# Altium schematic sheet Display LED 7s x6 + 8x8 x4.SchDoc
size 209 x 297 mm; Author: Мурашкин Д.В.; Address1: Address1; Address2: Address2; Address3: Address3; Address4: Address4; DocumentNumber: АБВГ.123456.001 Э3; Scale: 1:1; Letter1Column: Э; PartName: Деталь
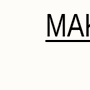
[diagram p0: Display LED 7s x6 + 8x8 x4.SchDoc]

## Notes on the sheet
- MAKING A 8×40 LED MATRIX <http://embedded-lab.com/blog/making-a-8x40-led-matrix-marquee-using-shift-registers/>
- Перв. примен.
- Справ. №
- Подп. и дата
- Инв. № дубл.
- Взам. инв. №
- Разраб.
- Изм.
- Лист
- № докум.
- Подп.
- Дата
- Лит.
- Масса
- Масштаб
- Пров.
- Т.контр.
- Листов
- Инв. № подл.
- Утв.
- Н.контр.
- 2.106-A4
- Копировал
- Формат А4